# EasyEDA Pro project OpenCardiographySignalMeasuringDevice.epro, board PCB_MasterProject
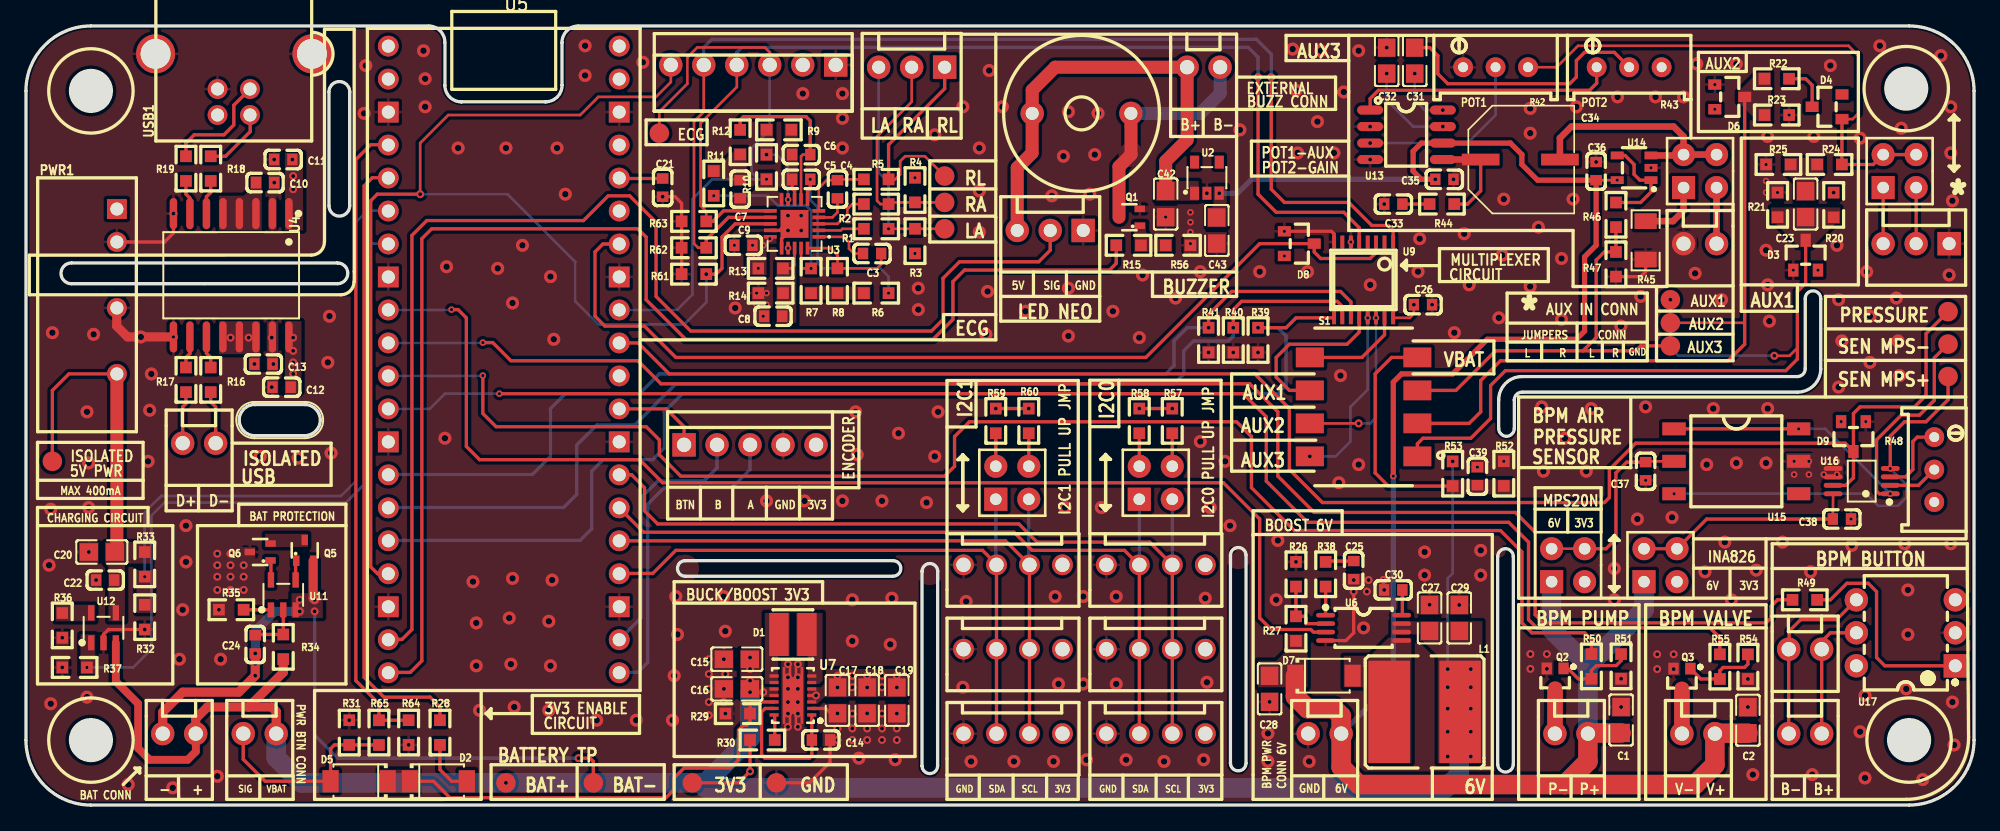
[diagram p6: board, top side]
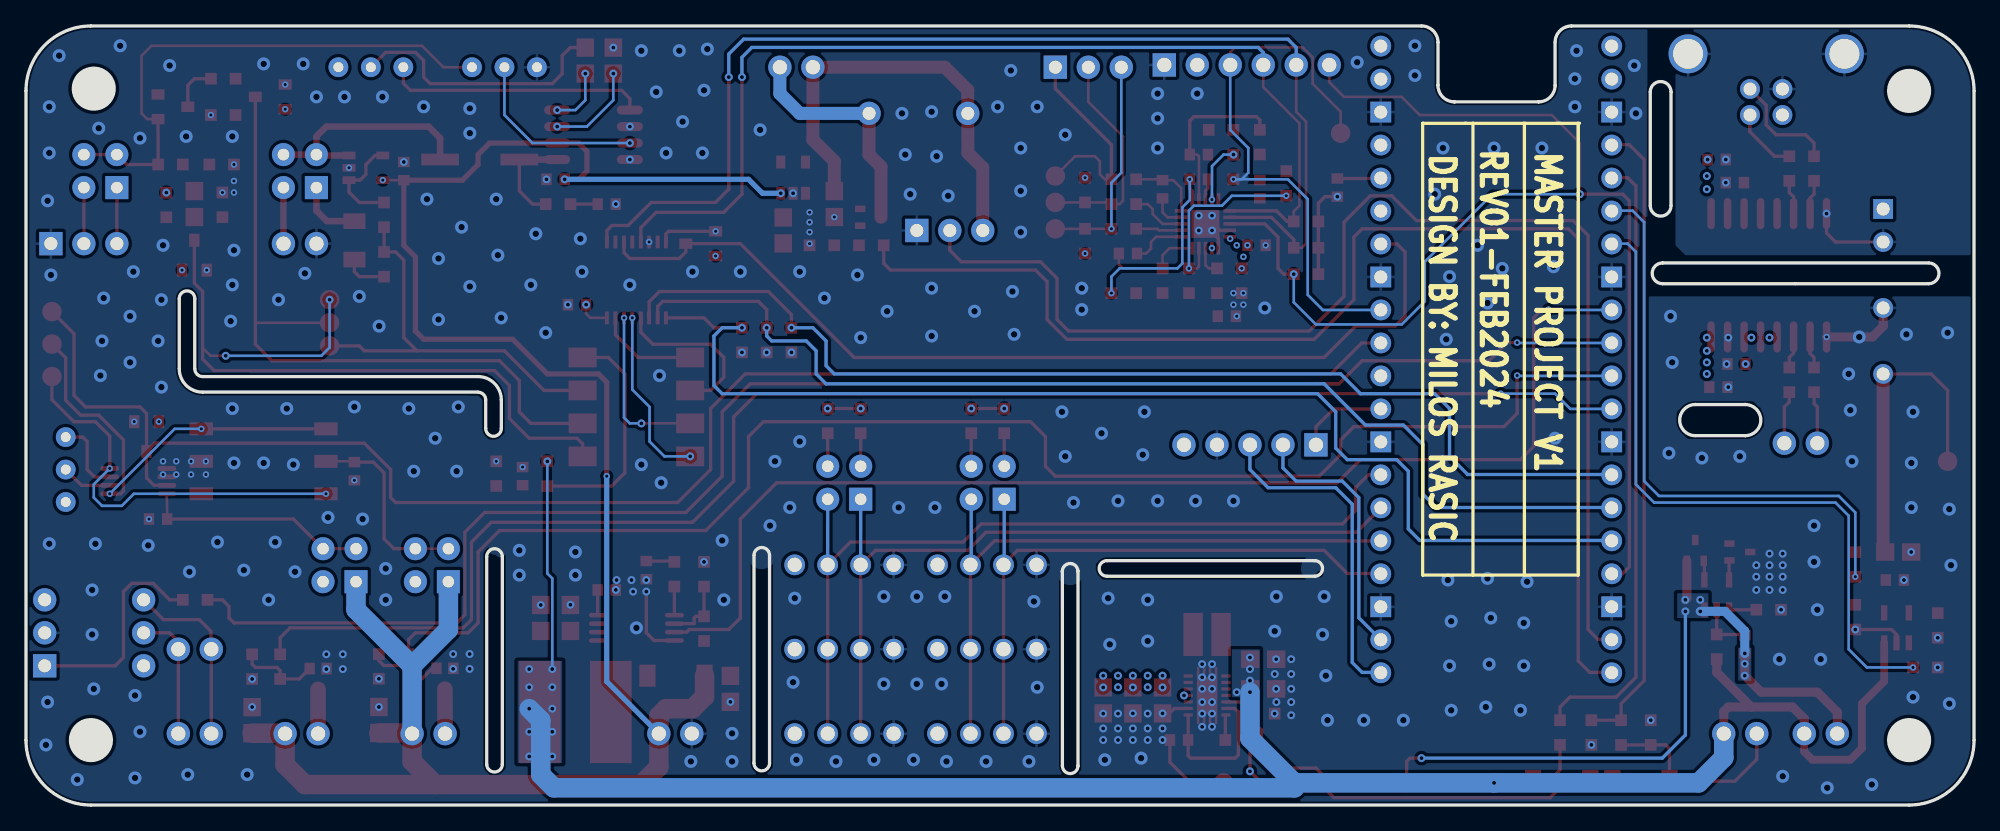
[diagram p7: board, bottom side, seen from below]

Outline 150 x 60 mm; copper layers: Top Layer, GND, 3V3, Bottom Layer. Coordinates in mm from the lower left corner of the outline.
Outline path: 0,55 arc(1.46,58.54) 5,60 30.99,60 arc(31.89,59.63) 32.26,58.73 32.26,55.43 32.26,55.43 arc(32.63,54.53) 33.53,54.16 33.53,54.16 40,54.16 40,54.16 arc(40.9,54.53) 41.28,55.43 41.28,58.73 41.27,58.73 arc(41.65,59.63) 42.55,60 145,60 arc(148.54,58.54) 150,55 150,5 arc(148.54,1.46) 145,0 5,0 arc(1.46,1.46) 0,5 0,55 ; 3.5,40.15 arc(2.7,40.95) 3.5,41.75 23.98,41.75 arc(24.78,40.95) 23.98,40.15 3.5,40.15 ; 17.62,30.85 17.62,30.85 arc(16.42,29.65) 17.62,28.45 21.46,28.45 arc(22.66,29.65) 21.46,30.85 21.46,30.85 17.62,30.85 ; 23.33,54.92 23.33,46.16 arc(24.13,45.36) 24.93,46.16 24.93,54.92 arc(24.13,55.72) 23.33,54.92 ; 50.77,18.82 66.76,18.82 arc(67.37,18.22) 66.76,17.62 50.77,17.62 arc(50.17,18.22) 50.77,18.82 ; 69,3.02 69,3.02 69,18 69,18 arc(69.6,18.6) 70.2,18 70.2,3.02 arc(69.6,2.42) 69,3.02 ; 92.75,19.23 arc(93.34,19.83) 93.94,19.23 93.94,3.23 arc(93.34,2.63) 92.75,3.23 92.75,19.23 ; 113.32,19.14 113.32,3.14 arc(113.92,2.54) 114.52,3.14 114.52,19.14 arc(113.92,19.74) 113.32,19.14 ; 113.4,31.2 113.4,29 arc(114,28.4) 114.6,29 114.6,31.2 arc(114.78,31.62) 115.2,31.8 136.4,31.8 arc(137.67,32.33) 138.2,33.6 138.2,39 arc(137.6,39.6) 137,39 137,33.6 arc(136.82,33.18) 136.4,33 115.2,33 arc(113.93,32.47) 113.4,31.2
Stack: Top Layer 0.035mm / Dielectric1 0.48mm PP er 4.5 / GND 0.035mm / Dielectric2 0.48mm FR4 er 4.5 / 3V3 0.035mm / Dielectric3 0.48mm PP er 4.5 / Bottom Layer 0.035mm

## Design rules (mm)
spacing Default (default): track to track 0.1, other pairs 0 to 0.1
track width Default (default): min 0.2, default 0.2, max 25.4
differential pair differentialPair (default): width min 0.127, default 0.254, max 2.54; gap min 0.152, default 0.152
via Default (default): diameter min 0.5, default 0.5, max 100.025; hole min 0.25, default 0.25, max 59.995
net GND uses gge34940
net USB_GND uses gge34982
net 5V_USB uses gge23894
net 3V3 uses gge34130
pour e198 uses gge34970
pour e199 uses gge34976
pour e211 uses gge23894
pour e212 uses gge34130
pour e213 uses gge23885
pour e214 uses gge34073
pour e966 uses gge34940
pour e967 uses gge34982

## Placement (name value [footprint] x y rotation side)
BUZZER1  BUZZER-12X9  [BUZ-TH_BD12.0-P7.60-D0.6-FD]  81.28 53.27 0 top
C1  10uF  [C0805]  122.82 6.55 90 top
C2  10uF  [C0805]  132.59 6.53 90 top
C3  33nF  [C0603]  65.15 42.47 0 top
C4  1nF  [C0603]  62.48 47.43 270 top
C5  330nF  [C0603]  59.69 48.19 180 top
C6  10nF  [C0603]  59.69 50.09 180 top
C7  1.5nF  [C0603]  54.99 47.43 270 top
C8  100nF  [C0603]  57.53 37.65 0 top
C9  100nF  [C0603]  55.25 43.11 0 top
C10  100nF  [C0603]  18.42 47.94 0 top
C11  100nF  [C0603]  19.81 49.71 0 top
C12  100nF  [C0603]  19.69 32.19 180 top
C13  100nF  [C0603]  18.29 33.97 0 top
C14  100nF  [C0603]  61.21 5.01 0 top
C15  10uF  [C0805]  54.74 11.23 0 top
C16  10uF  [C0805]  54.74 8.95 0 top
C17  22uF  [C0805]  62.48 8.06 90 top
C18  22uF  [C0805]  64.77 8.06 90 top
C19  22uF  [C0805]  67.06 8.06 90 top
C20  22uF  [C0805]  5.84 19.49 180 top
C21  100nF  [C0603]  49.02 47.55 270 top
C22  100nF  [C0603]  6.1 17.33 180 top
C23  10uF  [C0805]  137.03 46.28 90 top
C24  100nF  [C0603]  17.65 12.38 90 top
C25  1.1nF  [C0603]  102.24 18.09 90 top
C26  100nF  [C0603]  107.57 38.54 180 top
C27  22uF  [C0805]  108.08 14.41 90 top
C28  22uF  [C0805]  95.76 8.95 270 top
C29  1uF  [C0805]  110.36 14.41 90 top
C30  100nF  [C0603]  105.28 16.57 0 top
C31  10uF  [C0805]  106.93 57.33 90 top
C32  10uF  [C0805]  104.78 57.33 270 top
C33  50nF  [C0603]  105.28 46.28 180 top
C34  250uF  [8X10.5]  115.06 49.71 0 top
C35  100nF  [C0603]  109.22 48.19 0 top
C36  100nF  [C0603]  120.9 48.82 90 top
C37  100nF  [C0603]  124.71 25.71 90 top
C38  100nF  [C0603]  139.83 22.03 0 top
C39  100nF  [C0603]  111.76 25.33 90 top
C42  10uF  [C0805]  87.76 46.28 90 top
C43  10uF  [C0805]  91.69 44.25 90 top
CN1  kf2510_3A  [CONN-TH_3P-P2.00_KF2510_3A]  68.2 56.83 0 top
CN2  PICO USB SIGNAL  [CONN-TH_KF2510-2A]  13.33 27.87 0 top
CN3  kf2510_3A  [CONN-TH_3P-P2.00_KF2510_3A]  145.54 43.24 0 top
CN4  KF2510-6A  [CONN-TH_KF2510-6A]  56 57 180 top
CN5  Speaker  [CONN-TH_KF2510-2A]  128.91 43.24 0 top
CN6  BPM PSU  [CONN-TH_KF2510-2A]  100 5.5 0 top
CN7  BPM BUTTON  [CONN-TH_KF2510-2A]  137 12 0 top
CN8  BUTTON2  [CONN-TH_KF2510-2A]  137 5.5 0 top
CN9  PUMP  [CONN-TH_KF2510-2A]  119 5.5 0 top
CN10  VALVE  [CONN-TH_KF2510-2A]  128.78 5.5 0 top
CN11  Button  [CONN-TH_KF2510-2A]  18 5.5 0 top
CN12  Battery  [CONN-TH_KF2510-2A]  11.8 5.5 0 top
CN13  LED_CONN  [CONN-TH_3P-P2.00_KF2510_3A]  78.87 44.25 0 top
CN14  BUZZER  [CONN-TH_KF2510-2A]  90.68 56.83 0 top
D1  1.5uH  [IND-SMD_L3.0-W3.0-HPC3015TF-2R2M]  59.06 13.14 0 top
D2  RB050LAM-40TFTR  [SOD-128_L3.7-W2.5-LS4.7-RD]  31.75 1.83 0 top
D3  BAR43SFILM  [SOT-23_L2.9-W1.3-P1.90-LS2.4-BR]  137.03 42.35 270 top
D4  BAR43SFILM  [SOT-23_L2.9-W1.3-P1.90-LS2.4-BR]  138.68 53.78 0 top
D5  RB050LAM-40TFTR  [SOD-128_L3.7-W2.5-LS4.7-RD]  25.65 1.83 180 top
D6  BAR43SFILM  [SOT-23_L2.9-W1.3-P1.90-LS2.4-BR]  131.19 54.54 180 top
D7  RB050LAM-40TFTR  [SOD-128_L3.7-W2.5-LS4.7-RD]  99.95 9.96 0 top
D8  BAR43SFILM  [SOT-23_L2.9-W1.3-P1.90-LS2.4-BR]  98.04 43.24 180 top
D9  BAR43SFILM  [SOT-23_L2.9-W1.3-P1.90-LS2.4-BR]  140.72 28.38 90 top
L1  MSS7341-104MLD  [IND-SMD_L7.3-W7.3_MSS7341-104MLD]  107.7 7.17 0 top
MH1  M3 Screw  [MOUNTINGHOLE-M3]  5 5 0 top
MH2  M3 Screw  [MOUNTINGHOLE-M3]  145 5 0 top
MH3  M3 Screw  [MOUNTINGHOLE-M3]  144.78 55.17 0 top
MH4  M3 Screw  [MOUNTINGHOLE-M3]  5 55 0 top
P1  INA125 JMPR BLOCK  [2X2X2.54MM HEADER]  144.27 47.55 0 top
P2  SPEAKER JMP  [2X2X2.54MM HEADER]  128.91 47.55 0 top
P3  INA826_PWR_JMP  [2X2X2.54MM HEADER]  125.86 17.2 0 top
P4  Encoder  [CONN-TH_5P-P2.54_KF2510-5A]  55.75 27.74 0 top
P5  KF2510-4A  [CONN-TH_4P-P2.54_KF2510-4A]  87 18.5 0 top
P6  KF2510-4A  [CONN-TH_4P-P2.54_KF2510-4A]  87 12 0 top
P7  KF2510-4A  [CONN-TH_4P-P2.54_KF2510-4A]  87 5.5 0 top
P9  I2C PU  [2X2X2.54MM HEADER]  87 23.55 0 top
P10  I2C PU  [2X2X2.54MM HEADER]  75.95 23.55 0 top
P12  KF2510-4A  [CONN-TH_4P-P2.54_KF2510-4A]  76 18.5 0 top
P13  KF2510-4A  [CONN-TH_4P-P2.54_KF2510-4A]  76 12 0 top
P14  KF2510-4A  [CONN-TH_4P-P2.54_KF2510-4A]  76 5.5 0 top
P15  MPS_PWR_JMP  [2X2X2.54MM HEADER]  118.75 17.2 0 top
PWR1  TBA 2-1211  [PWRM-TH_TBA-2-1211]  7 39.55 270 top
Q1  BSS138BKW  [SOT323]  84.96 45.27 90 top
Q2  DMN2310UW-7  [PG-SOT323-3_L2.0-W1.3-P1.30-LS2.1-BR]  117.74 9.72 90 top
Q3  DMN2310UW-7  [PG-SOT323-3_L2.0-W1.3-P1.30-LS2.1-BR]  127.51 9.71 90 top
Q5  BSS138BKW  [SOT323]  21.46 19.61 0 top
Q6  BSS138BKW  [SOT323]  18.03 19.49 90 top
R1  .  [20K OHM RESISTOR (0603) SMD - CRCW060320K0FKEAC]  66.42 44.38 180 top
R2  .  [20K OHM RESISTOR (0603) SMD - CRCW060320K0FKEAC]  66.42 46.28 180 top
R3  .  [20K OHM RESISTOR (0603) SMD - CRCW060320K0FKEAC]  68.45 44.38 270 top
R4  .  [20K OHM RESISTOR (0603) SMD - CRCW060320K0FKEAC]  68.45 46.41 90 top
R5  .  [20K OHM RESISTOR (0603) SMD - CRCW060320K0FKEAC]  66.42 48.19 180 top
R6  .  [20K OHM RESISTOR (0603) SMD - CRCW060320K0FKEAC]  66.42 39.43 180 top
R7  .  [20K OHM RESISTOR (0603) SMD - CRCW060320K0FKEAC]  60.45 39.43 90 top
R8  .  [20K OHM RESISTOR (0603) SMD - CRCW060320K0FKEAC]  62.48 41.33 270 top
R9  .  [20K OHM RESISTOR (0603) SMD - CRCW060320K0FKEAC]  58.93 52 180 top
R10  .  [20K OHM RESISTOR (0603) SMD - CRCW060320K0FKEAC]  57.02 50.09 270 top
R11  .  [20K OHM RESISTOR (0603) SMD - CRCW060320K0FKEAC]  52.96 48.82 270 top
R12  .  [20K OHM RESISTOR (0603) SMD - CRCW060320K0FKEAC]  54.99 52 270 top
R13  .  [20K OHM RESISTOR (0603) SMD - CRCW060320K0FKEAC]  56.39 41.33 0 top
R14  .  [20K OHM RESISTOR (0603) SMD - CRCW060320K0FKEAC]  58.29 39.43 180 top
R15  .  [20K OHM RESISTOR (0603) SMD - CRCW060320K0FKEAC]  85.85 43.11 180 top
R16  .  [20K OHM RESISTOR (0603) SMD - CRCW060320K0FKEAC]  14.22 33.7 270 top
R17  .  [20K OHM RESISTOR (0603) SMD - CRCW060320K0FKEAC]  12.32 33.7 270 top
R18  .  [20K OHM RESISTOR (0603) SMD - CRCW060320K0FKEAC]  14.22 49.97 270 top
R19  .  [20K OHM RESISTOR (0603) SMD - CRCW060320K0FKEAC]  12.32 49.97 270 top
R20  .  [20K OHM RESISTOR (0603) SMD - CRCW060320K0FKEAC]  139.19 45.27 90 top
R21  .  [20K OHM RESISTOR (0603) SMD - CRCW060320K0FKEAC]  134.87 47.17 270 top
R22  .  [20K OHM RESISTOR (0603) SMD - CRCW060320K0FKEAC]  133.86 55.94 0 top
R23  .  [20K OHM RESISTOR (0603) SMD - CRCW060320K0FKEAC]  135.76 53.14 180 top
R24  .  [20K OHM RESISTOR (0603) SMD - CRCW060320K0FKEAC]  137.92 49.33 0 top
R25  .  [20K OHM RESISTOR (0603) SMD - CRCW060320K0FKEAC]  133.99 49.33 0 top
R26  .  [20K OHM RESISTOR (0603) SMD - CRCW060320K0FKEAC]  97.79 18.72 270 top
R27  .  [20K OHM RESISTOR (0603) SMD - CRCW060320K0FKEAC]  97.79 14.53 270 top
R28  .  [20K OHM RESISTOR (0603) SMD - CRCW060320K0FKEAC]  31.88 6.53 270 top
R29  .  [20K OHM RESISTOR (0603) SMD - CRCW060320K0FKEAC]  55.75 7.04 180 top
R30  .  [20K OHM RESISTOR (0603) SMD - CRCW060320K0FKEAC]  55.75 5.01 0 top
R31  .  [20K OHM RESISTOR (0603) SMD - CRCW060320K0FKEAC]  24.89 6.53 270 top
R32  .  [20K OHM RESISTOR (0603) SMD - CRCW060320K0FKEAC]  9.14 13.52 90 top
R33  .  [20K OHM RESISTOR (0603) SMD - CRCW060320K0FKEAC]  9.14 17.58 90 top
R34  .  [20K OHM RESISTOR (0603) SMD - CRCW060320K0FKEAC]  19.81 13.14 270 top
R35  .  [20K OHM RESISTOR (0603) SMD - CRCW060320K0FKEAC]  14.86 15.04 0 top
R36  .  [20K OHM RESISTOR (0603) SMD - CRCW060320K0FKEAC]  2.79 12.88 90 top
R37  .  [20K OHM RESISTOR (0603) SMD - CRCW060320K0FKEAC]  2.79 10.6 0 top
R38  .  [20K OHM RESISTOR (0603) SMD - CRCW060320K0FKEAC]  100.08 18.72 270 top
R39  .  [20K OHM RESISTOR (0603) SMD - CRCW060320K0FKEAC]  94.87 34.86 90 top
R40  .  [20K OHM RESISTOR (0603) SMD - CRCW060320K0FKEAC]  92.96 34.86 90 top
R41  .  [20K OHM RESISTOR (0603) SMD - CRCW060320K0FKEAC]  91.06 34.86 90 top
R42  10k  [RES-ADJ-TH_3P-L9.5-W4.85-P2.50-BL-BS]  113.16 56.83 90 top
R43  10k  [RES-ADJ-TH_3P-L9.5-W4.85-P2.50-BL-BS]  123.44 56.83 90 top
R44  .  [20K OHM RESISTOR (0603) SMD - CRCW060320K0FKEAC]  108.08 46.28 0 top
R45  8R2/1206  [R1206]  124.71 43.49 90 top
R46  .  [20K OHM RESISTOR (0603) SMD - CRCW060320K0FKEAC]  122.43 44.51 90 top
R47  .  [20K OHM RESISTOR (0603) SMD - CRCW060320K0FKEAC]  122.43 40.7 90 top
R48  20Ω  [RES-ADJ-TH_3P-L9.5-W4.85-P2.50-BL-BS]  146.94 25.84 0 top
R49  .  [20K OHM RESISTOR (0603) SMD - CRCW060320K0FKEAC]  137.92 15.8 180 top
R50  .  [20K OHM RESISTOR (0603) SMD - CRCW060320K0FKEAC]  120.54 9.72 90 top
R51  .  [20K OHM RESISTOR (0603) SMD - CRCW060320K0FKEAC]  122.82 9.72 90 top
R52  .  [20K OHM RESISTOR (0603) SMD - CRCW060320K0FKEAC]  113.79 26.47 270 top
R53  .  [20K OHM RESISTOR (0603) SMD - CRCW060320K0FKEAC]  109.85 24.57 90 top
R54  .  [20K OHM RESISTOR (0603) SMD - CRCW060320K0FKEAC]  132.59 9.71 90 top
R55  .  [20K OHM RESISTOR (0603) SMD - CRCW060320K0FKEAC]  130.43 9.71 90 top
R56  .  [20K OHM RESISTOR (0603) SMD - CRCW060320K0FKEAC]  89.66 43.11 180 top
R57  .  [20K OHM RESISTOR (0603) SMD - CRCW060320K0FKEAC]  88.26 30.54 270 top
R58  .  [20K OHM RESISTOR (0603) SMD - CRCW060320K0FKEAC]  85.72 30.54 270 top
R59  .  [20K OHM RESISTOR (0603) SMD - CRCW060320K0FKEAC]  74.68 30.54 270 top
R60  .  [20K OHM RESISTOR (0603) SMD - CRCW060320K0FKEAC]  77.22 30.54 270 top
R61  .  [20K OHM RESISTOR (0603) SMD - CRCW060320K0FKEAC]  50.48 40.89 0 top
R62  .  [20K OHM RESISTOR (0603) SMD - CRCW060320K0FKEAC]  50.48 42.92 0 top
R63  .  [20K OHM RESISTOR (0603) SMD - CRCW060320K0FKEAC]  50.48 44.95 0 top
R64  .  [20K OHM RESISTOR (0603) SMD - CRCW060320K0FKEAC]  29.46 6.53 270 top
R65  .  [20K OHM RESISTOR (0603) SMD - CRCW060320K0FKEAC]  27.18 4.63 90 top
S1  1825058-7  [SW_1825058-7]  103 30.66 180 top
TP1  Testpoint 3V3  [TESTPOINT]  51.31 1.71 0 top
TP2  Testpoint VBAT  [TESTPOINT]  36.96 1.71 0 top
TP3  Testpoint VBAT_NEG  [TESTPOINT]  43.69 1.71 0 top
TP4  Testpoint 6V  [TESTPOINT]  109.35 1.58 0 top
TP5  Testpoint GND  [TESTPOINT]  57.78 1.71 0 top
TP6  TP_ECG  [TESTPOINT]  48.77 51.75 0 top
TP7  TP_LA  [TESTPOINT]  70.74 44.38 0 top
TP8  TP_RA  [TESTPOINT]  70.74 46.41 0 top
TP9  TP_RL  [TESTPOINT]  70.74 48.44 0 top
TP10  TP_AUX1  [TESTPOINT]  126.62 38.92 0 top
TP11  TP_AUX2  [TESTPOINT]  126.62 37.14 0 top
TP12  TP_AUX3  [TESTPOINT]  126.62 35.36 0 top
TP13  5V_SAFE  [TESTPOINT]  2.03 26.47 0 top
TP14  TP_PRESSURE  [TESTPOINT]  148 38 0 top
TP15  MPS+  [TESTPOINT]  148 33 0 top
TP16  MPS-  [TESTPOINT]  148 35.5 0 top
U2  NCP716BSN500T1G  [TSOP-5_L3.0-W1.5-P0.95-LS2.8-BL]  90.93 48.32 0 top
U3  AD8232ACPZ-R7  [LFCSP-20_L4.0-W4.0-P0.50-TL-EP2.7]  59.18 44.76 180 top
U4  ADUM3160BRWZ-RL  [SOIC-16_L10.3-W7.5-P1.27-LS10.3-BL]  15.8 40.8 180 top
U5  Raspberry Pi Pico  [RASPBERRY PI PICO/ RASPBERRY PI PICO W]  26.29 8.82 0 top
U6  TPS61085PWR  [TSSOP-8_L4.4-W3.0-P0.65-LS6.4-BL]  103 13.64 270 top
U7  TPS63021DSJR  [VSON-14_L4.0-W3.0-P0.50-BL-EP_TI_DSJ]  59.06 8.44 90 top
U9  XS3A4051PWJ  [TSSOP16_]  103 40.44 180 top
U11  AP9101CK-AHTRG1  [SOT-23-5_L3.0-W1.7-P0.95-LS2.8-BL]  19.81 16.19 0 top
U12  MCP73831T-2ACI/OT  [SOT-23-5_L3.0-W1.7-P0.95-LS2.8-BL]  5.97 13.64 0 top
U13  LM386M-1/NOPB  [SOIC-8_L4.9-W3.9-P1.27-LS6.0-BL-2]  106.3 51.62 270 top
U14  MCP6001T-I/OT  [SOT-23-5_L3.0-W1.7-P0.95-LS2.8-BR]  123.82 49.08 0 top
U15  -  [MPS20N0040D-S]  131.7 26.47 0 top
U16  INA826AIDGK  [VSSOP-8_L3.0-W3.0-P0.65-LS4.9-BL]  141.35 24.95 90 top
U17  4N27M  [DIP-6_L8.8-W6.4-P2.54-LS7.6-BL]  144.75 13.26 90 top
USB1  670688000  [USB-B-TH_67068-8000]  16 55.5 180 top

## Footprints (pads in the part's own frame, mm; a bottom-side part is the same pattern mirrored in y, then rotated)
2X2X2.54MM HEADER
  rect 1.778x1.778 hole 0.889: 1(-1.27,0)
  round 1.778 hole 0.889: 2(1.27,0) 3(-1.27,2.54) 4(1.27,2.54)
8X10.5
  rect 2.9x0.9 smd: +(-3.05,0) -(3.05,0)
20K OHM RESISTOR (0603) SMD - CRCW060320K0FKEAC
  rect 0.9x0.9 smd: 1(0,0) 2(1.9,0)
BUZ-TH_BD12.0-P7.60-D0.6-FD
  round 1.8 hole 1: 1(-3.8,0) 2(3.8,0)
C0603
  rect 0.8x0.9 smd: 1(-0.7,0) 2(0.7,0)
C0805
  rect 1.41x1.35 smd: 1(-1,0) 2(1,0)
CONN-TH_3P-P2.00_KF2510_3A
  rect 1.8x1.8 hole 1: 1(2.54,0)
  round 1.8 hole 1: 2(0,0) 3(-2.54,0)
CONN-TH_4P-P2.54_KF2510-4A
  round 1.6 hole 1.1: 1(-3.81,0) 2(-1.27,0) 3(1.27,0) 4(3.81,0)
CONN-TH_5P-P2.54_KF2510-5A
  rect 1.8x1.8 hole 1.1: 1(-5.08,0)
  round 1.8 hole 1.1: 2(-2.54,0) 3(0,0) 4(2.54,0) 5(5.08,0)
CONN-TH_KF2510-2A
  round 1.8 hole 1.1: 1(1.27,0) 2(-1.27,0)
CONN-TH_KF2510-6A
  rect 1.8x1.8 hole 1.1: 1(-6.35,0)
  round 1.8 hole 1.1: 2(-3.81,0) 3(-1.27,0) 4(1.27,0) 5(3.81,0) 6(6.35,0)
DIP-6_L8.8-W6.4-P2.54-LS7.6-BL
  rect 1.8x1.8 hole 1: 1(-2.54,-3.81)
  round 1.8 hole 1: 2(0,-3.81) 3(2.54,-3.81) 4(2.54,3.81) 5(0,3.81) 6(-2.54,3.81)
IND-SMD_L3.0-W3.0-HPC3015TF-2R2M
  rect 1.5x3.32 smd: 1(1.078,0) 2(-1.078,0)
IND-SMD_L7.3-W7.3_MSS7341-104MLD
  rect 3.2x7.884 smd: 1(-2.73,0) 2(2.73,0)
LFCSP-20_L4.0-W4.0-P0.50-TL-EP2.7
  rect 0.985x0.28 smd: 1(-1.867,1) 2(-1.867,0.5) 3(-1.867,0) 4(-1.867,-0.5) 5(-1.867,-1) 11(1.867,-1) 12(1.867,-0.5) 13(1.867,0) 14(1.867,0.5) 15(1.867,1)
  rect 0.28x0.985 smd: 6(-1,-1.867) 7(-0.5,-1.867) 8(0,-1.867) 9(0.5,-1.867) 10(1,-1.867) 16(1,1.867) 17(0.5,1.867) 18(0,1.867) 19(-0.5,1.867) 20(-1,1.867)
  rect 2.15x2.15 smd: 21(0,0)
MPS20N0040D-S
  rect 1.8x1 smd: 1(-4.8,2.5) 2(-4.8,0) 3(-4.8,-2.5) 4(4.8,2.5) 5(4.8,0) 6(4.8,-2.5)
PG-SOT323-3_L2.0-W1.3-P1.30-LS2.1-BR
  rect 0.9x0.8 smd: 1(0.8,-0.65) 2(0.8,0.65) 3(-0.8,0)
PWRM-TH_TBA-2-1211
  rect 1.524x1.524 hole 1: 1(-6.35,0)
  round 1.524 hole 1: 2(-3.81,0) 4(1.27,0) 6(6.35,0)
R1206
  rect 1.208x1.701 smd: 1(-1.479,0) 2(1.479,0)
RASPBERRY PI PICO/ RASPBERRY PI PICO W
  round 1.6 hole 1: 1(1.61,49.63) 2(1.61,47.09) 4(1.61,42.01) 5(1.61,39.47) 6(1.61,36.93) 7(1.61,34.39) 9(1.61,29.31) 10(1.61,26.77) 11(1.61,24.23) 12(1.61,21.69) 14(1.61,16.61) 15(1.61,14.07) 16(1.61,11.53) 17(1.61,8.99) 19(1.61,3.91) 20(1.61,1.37) 21(19.39,1.37) 22(19.39,3.91) 24(19.39,8.99) 25(19.39,11.53) 26(19.39,14.07) 27(19.39,16.61) 29(19.39,21.69) 30(19.39,24.23) 31(19.39,26.77) 32(19.39,29.31) 34(19.39,34.39) 35(19.39,36.93) 36(19.39,39.47) 37(19.39,42.01) 39(19.39,47.09) 40(19.39,49.63)
  rect 1.6x1.6 hole 1: 3(1.61,44.55) 8(1.61,31.85) 13(1.61,19.15) 18(1.61,6.45) 23(19.39,6.45) 28(19.39,19.15) 33(19.39,31.85) 38(19.39,44.55)
RES-ADJ-TH_3P-L9.5-W4.85-P2.50-BL-BS
  round 1.524 hole 0.762: 1(0,2.5) 2(0,0) 3(0,-2.5)
SOD-128_L3.7-W2.5-LS4.7-RD
  rect 1.25x1.7 smd: 1(-2.2,0) 2(2.2,0)
SOIC-8_L4.9-W3.9-P1.27-LS6.0-BL-2
  oval 0.7x2 smd: 1(-1.905,-2.8) 2(-0.635,-2.8) 3(0.635,-2.8) 4(1.905,-2.8) 5(1.905,2.8) 6(0.635,2.8) 7(-0.635,2.8) 8(-1.905,2.8)
SOIC-16_L10.3-W7.5-P1.27-LS10.3-BL
  oval 0.574x2.401 smd: 1(-4.445,-4.75) 2(-3.175,-4.75) 3(-1.905,-4.75) 4(-0.635,-4.75) 5(0.635,-4.75) 6(1.905,-4.75) 7(3.175,-4.75) 8(4.445,-4.75) 9(4.445,4.75) 10(3.175,4.75) 11(1.905,4.75) 12(0.635,4.75) 13(-0.635,4.75) 14(-1.905,4.75) 15(-3.175,4.75) 16(-4.445,4.75)
SOT323
  custom 0.5x0.8 smd: 1(-0.65,-0.8) 2(0.65,-0.8) 3(0,0.8)
SOT-23-5_L3.0-W1.7-P0.95-LS2.8-BL
  rect 0.49x1.157 smd: 1(-0.95,-1.153) 2(0,-1.153) 3(0.95,-1.153)
  rect 0.49x1.175 smd: 4(0.95,1.153) 5(-0.95,1.153)
SOT-23-5_L3.0-W1.7-P0.95-LS2.8-BR
  rect 1x0.6 smd: 1(1.3,-0.95) 2(1.3,0) 3(1.3,0.95) 4(-1.3,0.95) 5(-1.3,-0.95)
SOT-23_L2.9-W1.3-P1.90-LS2.4-BR
  rect 1x0.8 smd: 1(1.15,-0.95) 2(1.15,0.95) 3(-1.15,0)
SW_1825058-7
  rect 2.159x1.519 smd: 1(-4.14,3.81) 2(4.14,3.81) 3(-4.14,1.27) 4(4.14,1.27) 5(-4.14,-1.27) 6(4.14,-1.27) 7(-4.14,-3.81) 8(4.14,-3.81)
TESTPOINT
  round 1.5 smd: 1(0,0)
TSOP-5_L3.0-W1.5-P0.95-LS2.8-BL
  rect 0.7x1 smd: 1(-0.95,-1.2) 2(0,-1.2) 3(0.95,-1.2) 4(0.95,1.2) 5(-0.95,1.2)
TSSOP16_
  rect 0.305x0.991 smd: 1(-2.273,-2.921) 2(-1.613,-2.921) 3(-0.953,-2.921) 4(-0.318,-2.921) 5(0.343,-2.921) 6(0.978,-2.921) 7(1.639,-2.921) 8(2.273,-2.921) 9(2.273,2.921) 10(1.639,2.921) 11(0.978,2.921) 12(0.343,2.921) 13(-0.318,2.921) 14(-0.953,2.921) 15(-1.613,2.921) 16(-2.273,2.921)
TSSOP-8_L4.4-W3.0-P0.65-LS6.4-BL
  oval 0.353x1.454 smd: 1(-0.975,-2.927) 2(-0.325,-2.927) 3(0.325,-2.927) 4(0.975,-2.927) 5(0.975,2.927) 6(0.325,2.927) 7(-0.325,2.927) 8(-0.975,2.927)
USB-B-TH_67068-8000
  round 1.524 hole 1: 1(1.25,2.355) 2(-1.25,2.355) 3(-1.25,0.355) 4(1.25,0.355)
  round 3 hole 2.3: 5(6.02,-2.354) 6(-6.02,-2.354)
VSON-14_L4.0-W3.0-P0.50-BL-EP_TI_DSJ
  rect 0.25x0.7 smd: 1(-1.5,-1.45) 2(-1,-1.45) 3(-0.5,-1.45) 4(0,-1.45) 5(0.5,-1.45) 6(1,-1.45) 7(1.5,-1.45) 8(1.5,1.45) 9(1,1.45) 10(0.5,1.45) 11(0,1.45) 12(-0.5,1.45) 13(-1,1.45) 14(-1.5,1.45)
  custom 4.4x1.58 smd: 15(0,0)
VSSOP-8_L3.0-W3.0-P0.65-LS4.9-BL
  oval 0.38x1.45 smd: 1(-0.975,-2.2) 2(-0.325,-2.2) 3(0.325,-2.2) 4(0.975,-2.2) 5(0.975,2.2) 6(0.325,2.2) 7(-0.325,2.2) 8(-0.975,2.2)

## Nets
As in the schematic.

Pads without a net: D4 2; R43 3; R48 3; U2 4 5; U5 1 2 30 35 37 39 40; U9 2 4 7; U15 6; U17 3 6

## Via types
v1: diameter 0.5, hole 0.25, Top Layer to Bottom Layer, 68 vias
v2: diameter 1, hole 0.5, Top Layer to Bottom Layer, 243 vias
v3: diameter 0.61, hole 0.305, Top Layer to Bottom Layer, 171 vias
v4: diameter 0.601, hole 0.305, Top Layer to Bottom Layer, 1 via

## Routing (per net, layer and track width the routed paths; a pad name or vN(x,y) marks a point on that pad's centre or on a via; arc(x,y) is an arc through that point)
3V3: length 18.1
  Top Layer w0.2: v3(106.87,38.54) 106.87,37.84 106.55,37.52 U9.16
  Top Layer w0.254: U5.36 45.71,48.25 C21.1 ; R30.1 v3(55.75,2.6) 54.86,1.71 TP1.1 ; v3(85.72,30.54) v3(88.26,30.54) ; v3(74.68,30.54) v3(77.22,30.54)
  vias: v1(55.94,43.11) v1(56.26,42.22) v1(56.39,41.33) v1(56.77,43.11) v1(57.28,43.62) v1(58.68,42.89) v1(68.45,48.31) v1(68.45,42.48) v1(96.89,42.29) v1(130.04,53.59) v1(137.98,41.2) v1(139.77,29.53) v3(15.75,36) v3(17.14,36) v3(17.59,33.97) v3(20.57,36) v3(20.57,34.98) v3(20.57,34.09) v3(20.57,33.2) v3(60.83,8.44) v3(62.48,9.96) v3(62.48,9.06) v3(63.63,9.96) v3(63.63,9.07) v3(64.77,9.96) v3(64.77,9.06) v3(65.91,9.96) v3(65.91,9.07) v3(67.06,9.96) v3(67.06,9.06) v3(139.19,47.17)
5V: length 34.2
  Top Layer w1: CN13.3 76.33,49.08 77.47,50.22 BUZZER1.1 77.48,55.06 79.25,56.83 CN14.2 89.41,51.24 87.76,49.59 C42.2
5V_SAFE: length 24.8
  Top Layer w0.254: PWR1.6 3.3,33.2 2.03,31.93 TP13.1
  Top Layer w1: PWR1.6 7,19.49 6.84,19.49
5V_USB:
  vias: v3(20.51,49.71) v3(20.57,48.44) v3(20.57,47.43)
6V: length 168.2
  Top Layer w0.2: C36.1 v1(122.52,48.13)
  Top Layer w0.4: 109.1,50.98 114.3,50.98 115.19,50.09 115.19,49.33 116.39,48.12 C36.1 120.9,43.11 120.01,42.22 120.01,36.5 119.38,35.87 112.52,35.87 109.85,33.2 105.92,33.2 105.28,32.57 v1(105.28,25.33) ; v3(108.52,48.19) 107.44,48.19 106.81,48.82 106.81,50.35 107.44,50.98 109.1,50.98
  Top Layer w1.5: C2.1 130.08,5.53 CN10.1 130.05,3.1 128.52,1.58 118.49,1.58 ; 120.27,5.52 120.3,5.55 C1.1 ; 118.49,1.58 120.27,3.36 CN9.1 ; 118.49,1.58 TP4.1 102.62,1.58 101.27,2.93 CN6.1 101.27,6.86 100.71,7.42 98.68,7.42 97.75,8.35 97.75,9.96
  Bottom Layer w0.4: v3(108.52,48.19) 94.36,48.19 93.29,47.12 v3(91.88,47.12) ; v1(105.28,25.33) 105.28,9.51 CN6.1
  Bottom Layer w1.5: P3.1 124.59,15.04 120.27,10.72 ; 120.27,10.72 117.47,13.52 P15.1 ; 120.27,10.72 CN9.1
GND: length 43.7
  Top Layer w0.254: U3.16 58.18,43.62 59.18,44.62 U3.21 58.55,44.76 58.04,44.25 57.31,44.26 ; v3(62.48,7.06) 61.96,7.06 61.58,7.44 60.51,7.44 ; R61.1 R62.1 R63.1 50.48,46.35 49.98,46.85 v3(49.02,46.85) ; TP5.1 60.32,1.71 61.91,3.3 C14.2 ; v1(96.89,44.19) 100.52,44.19 100.72,43.99 U9.8 ; R45.1 124.71,41.08 124.33,40.7 R47.1 ; v3(9.14,13.52) 6.35,13.52 5.97,13.14 U12.2 ; v3(102.24,16.44) 102.24,13.26 101.64,12.67 U6.4
  Top Layer w0.7: PWR1.4 6.98,36.89 7.82,36.05 v2(8.84,36.05) v1(11.35,36.05)
  vias: v1(54.55,43.11) v1(56.26,39.43) v1(56.26,38.54) v1(56.77,37.65) v1(57.02,39.43) v1(57.02,38.54) v1(87.76,45.28) v1(89.66,45.65) v1(89.66,44.89) v1(89.66,44.12) v1(89.66,43.24) v1(102.02,43.36) v1(111.76,26.03) v1(113.79,26.47) v1(124.71,25.01) v1(125.12,49.08) v1(130.04,55.49) v1(133.99,49.33) v1(133.99,48.06) v1(133.99,47.17) v1(134.87,47.17) v1(135.76,53.14) v1(136.08,41.2) v1(136.14,26.47) v1(136.14,25.46) v1(137.29,26.47) v1(137.29,25.46) v1(138.43,26.47) v1(138.43,25.46) v1(139.45,26.47) v1(139.45,25.46) v1(140.53,22.03) v1(141.67,29.53) v2(1.78,18.47) v2(1.91,22.79) v2(1.91,7.8) v2(2.03,36.38) v2(4.7,30.28) v2(4.7,8.31) v2(4.83,26.34) v2(4.83,22.92) v2(5.21,36.25) v2(7.87,1.58) v2(9.4,26.47) v2(9.53,30.41) v2(9.65,33.2) v2(11.3,1.33) v2(11.81,11.23) v2(12.06,15.04) v2(12.32,21.52) v2(12.32,18.72) v2(14.73,2.22) v2(14.99,11.23) v2(18.03,26.85) v2(20.95,26.73) v2(23.24,34.09) v2(23.37,37.65) v2(23.5,27.11) v2(26.03,53.27) v2(26.16,56.95) v2(30.61,58.09) v2(30.73,55.94) v2(30.73,53.78) v2(32.26,28.25) v2(32.39,41.46) v2(33.27,50.6) v2(34.42,17.2) v2(34.67,14.03) v2(34.67,10.72) v2(34.92,7.29) v2(36.32,41.33) v2(36.96,50.6) v2(37.21,14.41) v2(37.34,10.85) v2(37.47,38.66) v2(37.47,17.45) v2(37.59,7.55) v2(38.23,43.11) v2(40.26,14.15) v2(40.26,7.29) v2(40.39,40.7) v2(40.39,10.72) v2(40.51,17.33) v2(40.64,35.87) v2(40.89,50.6) v2(41.53,47.05) v2(43.05,58.48) v2(43.05,56.19) v2(43.94,6.53) v2(46.99,6.53) v2(47.5,57.21) v2(49.78,6.53) v2(49.91,9.96) v2(50.04,16.06) v2(50.17,13.14) v2(53.72,16.06) v2(53.85,13.39) v2(54.61,38.28) v2(57.02,23.42) v2(59.82,54.79) v2(59.94,23.42) v2(62.87,54.79) v2(62.87,52.89) v2(62.87,50.6) v2(62.87,23.42) v2(63.63,15.8) v2(63.63,12.63) v2(63.88,30.28) v2(64.01,26.98) v2(64.13,3.61) v2(65.91,23.42) v2(66.55,12.38) v2(66.68,15.93) v2(66.93,3.49) v2(67.18,28.63) v2(68.71,39.81) v2(68.71,38.16) v2(69.34,23.3) v2(69.98,51.62) v2(69.98,26.85) v2(70.23,30.28) v2(72.14,53.78) v2(72.14,9.07) v2(72.39,15.68) v2(72.77,3.36) v2(73.41,50.6) v2(73.41,47.3) v2(73.41,44.12) v2(73.91,36.25) v2(74.04,39.55) v2(74.17,56.57) v2(75.18,53.78) v2(76.07,3.36) v2(76.96,38.03) v2(78.99,46.92) v2(79.12,3.36) v2(79.25,16.06) v2(79.5,9.33) v2(79.88,49.97) v2(80.01,22.92) v2(80.26,53.4) v2(80.26,39.81) v2(80.26,36.12) v2(81.41,16.06) v2(81.41,9.33) v2(81.66,3.49) v2(81.91,47.05) v2(82.3,50.09) v2(82.55,53.27) v2(82.8,22.92) v2(83.69,38.03) v2(83.95,16.06) v2(83.95,9.33) v2(84.71,3.49) v2(85.72,36) v2(85.98,40.82) v2(87.63,3.36) v2(88.52,39.05) v2(90.42,41.08) v2(90.42,28) v2(90.68,3.49) v2(90.81,15.93) v2(90.93,9.45) v2(91.19,22.92) v2(92.33,26.47) v2(92.71,21.52) v2(93.47,52) v2(95,41.08) v2(95.63,5.52) v2(95.63,3.36) v2(96.27,15.8) v2(96.39,20.38) v2(97.54,58.22) v2(97.79,55.05) v2(97.92,50.22) v2(98.68,41.08) v2(98.81,3.36) v2(99.44,52.63) v2(99.69,58.09) v2(100.71,50.22) v2(101.09,24.82) v2(101.22,33.08) v2(101.47,54.92) v2(102.62,58.09) v2(102.62,26.22) v2(103,13.64) v2(103.5,40.06) v2(107.19,41.08) v2(107.31,43.62) v2(107.7,19.49) v2(107.7,17.71) v2(109.98,36.38) v2(110.74,44) v2(111.12,40.06) v2(112.01,19.61) v2(112.01,17.71) v2(113.41,37.52) v2(113.66,42.35) v2(113.79,46.67) v2(115.82,53.65) v2(115.82,51.75) v2(115.82,39.93) v2(116.46,44.51) v2(116.71,30.66) v2(116.84,25.71) v2(118.24,42.09) v2(118.24,37.39) v2(118.49,28.25) v2(119.13,46.67) v2(119.38,53.78) v2(120.14,25.71) v2(120.52,30.54) v2(122.3,18.22) v2(122.3,15.8) v2(122.56,54.54) v2(122.81,36.89) v2(124.08,22.03) v2(124.33,39.17) v2(124.71,30.66) v2(125.48,54.54) v2(126.75,22.15) v2(127.63,54.54) v2(128.52,40.95) v2(128.65,57.08) v2(129.29,17.96) v2(129.41,26.22) v2(129.92,30.54) v2(130.56,38.92) v2(130.81,20.25) v2(131.32,15.8) v2(131.7,57.08) v2(131.7,26.34) v2(132.97,2.34) v2(133.22,18.09) v2(133.99,42.73) v2(133.99,26.34) v2(134.11,51.49) v2(134.11,40.06) v2(134.11,30.54) v2(134.24,37.27) v2(135.25,20.25) v2(137.41,17.96) v2(137.54,2.34) v2(137.67,51.49) v2(138.94,56.95) v2(139.45,43.11) v2(139.57,38.92) v2(139.57,32.19) v2(139.83,35.74) v2(140.59,20) v2(141.22,51.36) v2(141.22,5.64) v2(141.6,8.44) v2(141.6,2.09) v2(141.73,41.08) v2(141.99,37.65) v2(141.99,34.09) v2(142.75,58.48) v2(144.02,39.05) v2(144.15,35.74) v2(144.27,33.08) v2(144.4,52.13) v2(144.65,20.12) v2(144.78,8.95) v2(144.91,16.57) v2(144.91,13.14) v2(146.05,1.96) v2(147.45,57.71) v2(148.08,40.82) v2(148.21,53.78) v2(148.21,50.22) v2(148.21,20.12) v2(148.34,46.54) v2(148.34,7.93) v2(148.46,4.63) v3(2.79,12.88) v3(2.79,10.6) v3(4.84,19.49) v3(5.4,17.33) v3(14.73,19.36) v3(14.73,18.47) v3(14.73,17.58) v3(14.73,16.57) v3(14.86,15.04) v3(15.75,19.36) v3(15.75,18.47) v3(15.75,17.58) v3(15.75,16.57) v3(16.76,18.47) v3(16.76,17.58) v3(16.76,16.57) v3(18.92,36) v3(18.92,32.19) v3(19.05,33.97) v3(24.89,6.53) v3(29.46,4.63) v3(52.58,11.23) v3(52.58,10.09) v3(52.58,8.95) v3(52.58,7.93) v3(52.58,6.91) v3(53.74,11.23) v3(53.74,8.95) v3(53.72,7.93) v3(53.85,10.09) v3(53.85,7.04) v3(58.67,45.39) v3(58.67,44.25) v3(58.67,10.85) v3(58.67,9.84) v3(58.67,8.95) v3(58.67,7.93) v3(58.67,7.04) v3(58.67,6.03) v3(59.44,10.85) v3(59.44,9.84) v3(59.44,8.95) v3(59.44,7.93) v3(59.44,7.04) v3(59.44,6.03) v3(59.69,45.39) v3(59.69,44.25) v3(62.48,5.9) v3(62.48,5.01) v3(63.63,7.04) v3(63.63,5.9) v3(63.63,5.01) v3(64.77,7.06) v3(64.77,5.9) v3(64.77,5.01) v3(65.91,7.04) v3(65.91,5.9) v3(65.91,5.01) v3(67.06,7.04) v3(67.06,5.9) v3(67.06,5.01) v3(90.93,47.12) v3(91.06,34.86) v3(92.96,34.86) v3(94.87,34.86) v3(95.76,7.95) v3(97.79,18.72) v3(102.24,17.33) v3(103.25,16.44) v3(103.38,17.33) v3(103.5,52.25) v3(103.5,49.71) v3(104.52,17.33) v3(104.58,46.28) v3(104.58,16.57) v3(104.78,58.33) v3(108.08,15.42) v3(108.27,38.54) v3(110.36,15.41) v3(115.84,11.63) v3(115.84,10.49) v3(117.11,11.63) v3(117.11,10.49) v3(120.9,49.52) v3(122.82,9.72) v3(122.82,7.55) v3(125.6,11.61) v3(125.6,10.47) v3(126.87,11.61) v3(126.87,10.47) v3(132.59,9.71) v3(132.59,7.55) v4(109.92,48.19)
VBAT: length 154.2
  Top Layer w0.6: U12.3 6.92,9.52 8.64,7.8 8.64,4.37 9.53,3.49 12.45,3.49 13.08,4.12 13.07,5.5
  Top Layer w0.7: 17.14,7.55 19.81,10.22 R34.2 ; 17.14,7.55 13.97,7.55 13.07,6.65 13.07,5.5 ; 17.14,7.55 18.92,7.55 19.27,7.2 CN11.1
  Bottom Layer w0.2: v3(109.85,26.47) 109.85,17.84 109.47,17.45 v3(109.47,10.47)
  Bottom Layer w1.5: v3(111.25,7.42) 110.36,6.53 110.36,2.34 109.35,1.33 52.32,1.33 52.32,1.71 ; 52.32,1.71 55.75,5.14 v3(55.75,8.69) ; 52.32,1.71 v3(36.96,1.71) 21.21,1.71 19.27,3.65 CN11.1
  vias: v3(55.75,11.36) v3(55.75,10.47) v3(55.75,9.58) v3(56.77,8.69) v3(109.47,9.07) v3(109.47,7.42) v3(109.47,5.64) v3(109.47,3.74) v3(111.25,10.47) v3(111.25,9.07) v3(111.25,5.64) v3(111.25,3.74)
VBAT_NEG: length 54
  Top Layer w0.254: v3(42.55,3.61) 43.43,3.61 43.69,3.36 TP3.1
  Top Layer w0.7: Q5.2 22.11,15.92 v3(22.22,15.8) ; v3(17.65,11.68) v3(17.65,10.88) v3(17.65,9.96) 16.38,8.69 12.06,8.69 10.53,7.16 CN12.2
  Bottom Layer w0.254: v3(22.22,14.92) 22.22,5.39 24,3.61 v3(42.55,3.61)
  Bottom Layer w0.7: v3(21.08,14.92) 19.18,14.92 17.65,13.39 v3(17.65,11.68)
  vias: v3(21.08,15.8)
AUX1: length 57.8
  Top Layer w0.2: 136.4,35.21 135.79,34.6 v3(134.62,34.6)
  Top Layer w0.254: 137.03,43.5 137.03,40.19 136.4,39.55 136.4,34.35 135.51,33.46 113.92,33.46 112.78,32.31 112.78,29.77 111.25,28.25 107.57,28.25 107.14,27.82 S1.1
  Bottom Layer w0.2: v3(126.62,38.92) 126.62,35.23 127.25,34.6 v3(134.62,34.6)
AUX2: length 54
  Top Layer w0.2: 132.34,37.01 132.21,37.14 TP11.1
  Top Layer w0.254: S1.3 111.12,29.39 112.01,30.28 112.01,32.69 113.54,34.22 131.06,34.22 132.34,35.5 132.34,54.54
AUX3: length 32
  Top Layer w0.254: 119.89,34.98 120.9,36 120.9,41.97 121.53,42.6 R47.2 R46.1 ; 119.89,34.98 113.16,34.98 110.11,31.93 S1.5 ; 119.89,34.98 123.95,34.98 124.33,35.36 TP12.1
AUX_SIG: length 41.9
  Top Layer w0.2: R42.3 117.86,56.83 119.51,58.48 140.34,58.48 141.1,57.71 141.1,53.27 140.66,52.83 D4.1
  Top Layer w0.254: P1.4 P1.3 142.24,49.33 R24.2 D4.1
BAT: length 17.8
  Top Layer w0.254: R53.1 104.9,24.57 103.89,25.58 103.89,33.2 105.16,34.47 S1.7
BUTTON_SIG: length 49.2
  Top Layer w0.254: R64.1 R65.2 27.18,7.8 25.4,9.58 25.4,49.71 26.54,50.86 27.87,50.86 U5.4
BUZZER1_2: length 17.9
  Top Layer w1: 84.16,45.27 84.16,49.17 85.09,50.09 BUZZER1.2
  Bottom Layer w1: BUZZER1.2 90.42,53.27 91.95,54.79 CN14.1
C14_1: length 11.6
  Top Layer w0.254: 60.51,6.94 60.51,5.01 60.51,3.8 60.32,3.61 56.9,3.61 56.64,3.87 56.64,7.17 56.91,7.44 57.6,7.44
C24_2: length 4.1
  Top Layer w0.254: U11.2 R34.1 17.72,13.14 C24.2
C34_-: length 18.3
  Top Layer w0.5: P2.3 127.57,50.03 U14.3 ; P2.3 127.63,51.49 126.87,52.25 119,52.25 118.11,51.37 C34.- ; P2.3 P2.4
C37_2: length 15.2
  Top Layer w0.2: C37.2 124.78,26.47 U15.2 ; P15.3 P15.4
  Top Layer w0.254: P15.4 121.67,19.74 122.43,20.5 122.43,25.58 123.25,26.41 C37.2
CN1_1: length 16.7
  Top Layer w0.2: TP9.1 69.22,49.97 67.69,49.97 67.31,49.59 67.31,48.57 66.93,48.19 R5.1
  Top Layer w0.254: CN1.1 70.74,55.17 66.42,50.86 R5.1
CN3_2: length 4.3
  Top Layer w0.254: P1.2 CN3.2
CN3_3: length 4.3
  Top Layer w0.254: P1.1 CN3.3
CN9_2: length 3.4
  Top Layer w1.2: Q2.3 117.73,5.52
CN10_2: length 3.4
  Top Layer w1.2: Q3.3 CN10.2
D4_3: length 3.6
  Top Layer w0.254: R22.2 137.03,55.94 137.53,55.44 D4.3
D5_1: length 34.2
  Top Layer w0.254: D2.1 31.37,1.83 32.64,0.56 49.28,0.56 49.91,1.2 49.91,2.09 50.67,2.85 54.23,2.85 54.86,3.49 54.86,5.77 55.25,6.15 55.5,6.15 55.75,6.41 R29.1 55.75,7.68 56.02,7.94 U7.12
I2C0_SCL: length 64.6
  Top Layer w0.254: U5.27 46.64,25.43 47.62,24.44 47.62,22.66 48.64,21.65 76.45,21.65 77.85,20.25 86.52,20.25 P5.3 P6.3 P7.3
  Bottom Layer w0.254: 88.26,23.55 P5.3
I2C0_SDA: length 59.9
  Top Layer w0.254: P7.2 P6.2 P5.2 85.7,18.5 84.58,19.61 77.47,19.61 76.07,21.01 47.56,21.01 U5.26
  Bottom Layer w0.254: P9.1 P5.2
I2C1_SCL: length 50.4
  Top Layer w0.254: U5.25 75.42,20.35 P12.3 P13.3 P14.3
  Bottom Layer w0.254: P12.3 77.22,18.55 P10.2
I2C1_SDA: length 48.4
  Top Layer w0.254: P14.2 P13.2 P12.2 74.73,18.54 73.66,19.61 50.04,19.61 48.26,17.84 45.71,17.84 U5.24
  Bottom Layer w0.254: P12.2 74.68,18.55 P10.1
MCP_CHRG: length 53.3
  Bottom Layer w0.2: U5.7 27.87,43.24 26.67,43.24 26.03,42.6 26.03,24.69 24.64,23.3 10.67,23.3 9.65,22.28 9.65,11.99 8.25,10.6 v1(4.69,10.6)
MUX_A: length 85.4
  Top Layer w0.254: U9.11 102.02,38.75 101.22,39.55 92.84,39.55 91.06,37.78 v3(91.06,36.76)
  Bottom Layer w0.254: U5.14 27.92,25.46 38.99,25.46 40.39,26.85 40.39,30.54 41.53,31.68 47.24,31.68 48.77,33.2 87.76,33.2 88.39,33.84 88.39,35.74 89.41,36.76 v3(91.06,36.76)
MUX_B: length 85.6
  Top Layer w0.254: U9.10 101.36,38.4 100.97,38.79 93.6,38.79 92.96,38.16 v3(92.96,36.76)
  Bottom Layer w0.254: v3(92.96,36.76) 92.96,36.12 92.58,35.74 89.92,35.74 89.15,34.98 89.15,33.2 88.39,32.44 50.04,32.44 46.86,29.27 43.94,29.27 42.42,27.74 42.42,23.93 41.4,22.92 27.92,22.92 U5.15
MUX_C: length 90.7
  Top Layer w0.254: v3(94.87,36.76) 97.03,36.76 97.79,37.52 U9.9
  Bottom Layer w0.254: U5.16 27.93,20.38 42.67,20.38 43.56,21.27 43.56,25.71 44.45,26.6 48.26,26.6 49.15,27.49 49.15,30.28 50.55,31.68 96.39,31.68 97.03,32.31 97.03,36.12 96.39,36.76 v3(94.87,36.76)
P2_2: length 4.3
  Top Layer w0.5: P2.2 CN5.1
P9_3: length 2.5
  Top Layer w0.254: R58.2 P9.3
P9_4: length 2.5
  Top Layer w0.254: R57.2 88.26,26.09
PICO_AUX: length 74
  Top Layer w0.254: U9.3 103.95,42.54 103.5,42.09 99.69,42.09 99.19,42.59 D8.3 95,43.24 86.23,34.47 50.04,34.47 47.62,36.89 44.58,36.89 43.81,37.65 43.81,42.6 44.42,43.21 U5.34
PICO_BPM_AN: length 126.4
  Top Layer w0.254: 139.15,24.62 140.14,24.62 140.72,25.2 140.72,27.23 ; TP14.1 146.3,36.3 146.3,31.55 145.41,30.66 141.22,30.66 140.72,30.16 D9.3 140.08,27.87 123.95,27.87 121.92,25.84 121.92,23.68 121.54,23.3 99.82,23.3 97.28,25.84 97.28,30.54 94.62,33.2 49.53,33.2 47.14,35.59 U5.31
PICO_BPM_BTN: length 125
  Top Layer w0.254: v1(35.18,35.62) 35.94,35.62 37.34,34.22 47.12,34.22 48.89,32.44 94.23,32.44 96.39,30.28 96.39,25.33 99.19,22.53 114.68,22.53 116.21,21.01 116.21,14.66 116.84,14.03 133.99,14.03 134.37,14.41 134.37,15.3 134.87,15.8 R49.2
  Bottom Layer w0.2: U5.10 35.15,35.59 v1(35.18,35.62)
PICO_BPM_PUMP: length 114.9
  Top Layer w0.254: 120.54,11.63 120.54,12.74 120.01,13.26 115.95,13.26 115.19,14.03 115.19,19.49 113.54,21.14 97.66,21.14 94.36,24.44 94.36,28.38 93.22,29.52 72.64,29.52 71.5,28.38 71.5,26.09 70.74,25.33 50.42,25.33 48.77,26.98 48.77,28.12 47.75,29.14 36.19,29.14 35.18,30.16 v1(35.18,33.08)
  Bottom Layer w0.2: v1(35.18,33.08) 35.15,33.05 U5.11
PICO_BPM_PWR: length 92.7
  Top Layer w0.254: 100.07,13.32 99.13,13.32 98.93,13.52 95.88,13.52 95,14.41 95,22.03 92.2,24.82 49.02,24.82 47.24,26.6 34.92,26.6 33.91,27.61 33.91,37.52 33.27,38.16 v1(32.77,38.16)
  Bottom Layer w0.2: U5.9 32.74,38.13 v1(32.77,38.16)
PICO_BPM_VALVE: length 118.5
  Top Layer w0.254: R55.2 130.43,12.88 129.67,13.64 116.33,13.64 115.7,14.28 115.7,20.25 114.17,21.77 98.68,21.77 95.5,24.95 95.5,29.9 93.73,31.68 v1(36.45,31.68)
  Bottom Layer w0.2: v1(36.45,31.68) 32.26,31.68 31.09,30.51 U5.12
PICO_BUZZ: length 101.1
  Top Layer w0.254: U5.20 27.92,10.22 29.59,10.22 30.48,11.1 30.48,43.62 31.24,44.38 47.12,44.38 47.75,43.74 47.75,38.92 50.8,35.87 69.85,35.87 71.37,37.39 71.37,40.31 72.26,41.2 83.44,41.2 83.95,41.72 R15.2
PICO_EBT: length 7
  Top Layer w0.254: P4.1 50.67,29.14 49.3,30.51 U5.29
PICO_ECG_AN: length 44.6
  Top Layer w0.2: TP6.1 48.77,53.4 50.93,55.56 50.93,57.59 51.69,58.35 56.9,58.35 57.28,57.97 CN4.3
  Bottom Layer w0.2: CN4.3 57.27,51.99 55.88,50.6 55.88,48.7 56.39,48.19 v1(57.02,48.19) 52.83,48.19 51.31,46.67 51.31,39.3 50.14,38.13 U5.32
PICO_ECG_LN: length 80.7
  Top Layer w0.2: CN4.4 54.74,55.3 51.94,52.51 51.94,46.16 52.38,45.72 R63.2
  Top Layer w0.254: U9.5 102.65,44.47 101.47,45.65 96.27,45.65 94.87,47.05 v3(94.87,56.06) ; U3.11 53.7,45.76 52.9,44.95 R63.2
  Bottom Layer w0.254: CN4.4 54.73,57.96 55.12,58.35 94.11,58.35 94.87,57.59 v3(94.87,56.06)
PICO_ECG_LP: length 89.2
  Top Layer w0.2: CN4.5 52.19,53.39 51.44,52.63 51.44,43.24 51.75,42.92 R62.2
  Top Layer w0.254: U3.12 54.09,45.26 52.38,43.55 R62.2 ; U9.1 105.27,44.24 104.9,44.63 103.63,44.63 101.85,46.41 96.9,46.41 95.88,47.43 v3(95.88,56.06)
  Bottom Layer w0.254: v3(95.88,56.06) 95.88,57.84 94.74,58.98 52.83,58.98 52.19,58.34 CN4.5
PICO_ECG_SIG: length 99.1
  Top Layer w0.2: v3(30.35,47.05) 30.35,50.98 32.51,53.14 42.67,53.14 44.07,54.54 48.51,54.54 49.66,55.68 CN4.6
  Top Layer w0.254: v3(52.38,40.89) 53.15,40.89 53.59,41.33 53.59,43.74 54.61,44.76 57.31,44.76 ; U5.17 27.08,17.81 26.54,18.34 26.54,46.54 27.05,47.05 v3(30.35,47.05)
  Bottom Layer w0.2: v3(52.38,40.89) 52.38,38.72 50.67,37.01 44.07,37.01 42.29,38.79 42.29,41.84 37.08,47.05 v3(30.35,47.05)
PICO_ENA: length 25.6
  Bottom Layer w0.254: P4.3 55.75,25.84 54.36,24.44 49.15,24.44 47.88,23.17 47.88,10.98 47.12,10.22 45.71,10.22 U5.21
PICO_ENB: length 20.2
  Bottom Layer w0.254: P4.2 53.21,25.96 52.2,24.95 48.64,24.95 47.37,23.68 47.37,14.42 U5.22
PICO_LED: length 96.5
  Top Layer w0.254: CN13.2 78.87,42.73 77.98,41.84 71.88,41.84 70.61,40.57 70.61,37.39 69.72,36.5 51.18,36.5 48.51,39.17 48.51,44.89 46.48,46.92 44.83,46.92 42.93,45.01 30.86,45.01 29.72,43.87 29.72,13.52 28.96,12.76 27.92,12.76 U5.19
POWER_LATCH: length 47.8
  Top Layer w0.254: R28.1 31.88,7.55 31.11,8.31 27.56,8.31 26.03,9.84 26.03,47.68 26.67,48.32 27.87,48.32 U5.5
Q5_1: length 1.5
  Top Layer w0.254: U11.4 20.76,18.76 Q5.1
Q6_1: length 1.5
  Top Layer w0.254: Q6.1 18.86,18.81 U11.5
R1_1: length 17.1
  Top Layer w0.2: v1(66.42,44.38) R3.1 TP7.1
  Bottom Layer w0.2: v1(66.42,44.38) 66.42,47.94 65.66,48.7 CN1.3
R2_1: length 16.8
  Top Layer w0.2: TP8.1 R4.1 66.55,46.41 R2.1 65.79,46.28 65.53,46.54 65.53,51.49 68.2,54.16 CN1.2
R16_2: length 4.1
  Top Layer w0.254: CN2.1 14.61,30.66 14.22,31.04 R16.2
R17_2: length 4
  Top Layer w0.254: R17.2 12.32,30.92 12.06,30.66 CN2.2
R18_1: length 5.1
  Top Layer w0.254: R18.1 15.37,49.97 17.27,51.87 17.25,53.14
R19_1: length 8.6
  Top Layer w0.254: USB1.3 16,53.9 16,52.38 15.24,51.62 12.95,51.62 12.32,50.98 R19.1
R28_2: length 4.4
  Top Layer w0.254: R28.2 31.88,2.72 32.77,1.83 D2.2
R30_2: length 1.9
  Top Layer w0.254: R30.2 57.65,6.89 U7.14
R31_2: length 15.8
  Top Layer w0.254: R65.1 R31.2 23.75,4.63 23.45,4.33 D5.2 18.42,1.83 16.73,3.52 CN11.2
R35_2: length 2.1
  Top Layer w0.254: U11.1 R35.2
R38_1: length 2.2
  Top Layer w0.254: R38.1 100.14,18.79 C25.2
R43_2: length 20.7
  Top Layer w0.254: 106.93,58.33 108.09,58.33 108.71,57.71 108.71,56.32 109.47,55.56 118.87,55.56 119.38,56.06 119.38,57.33 120.01,57.97 122.3,57.97 R43.2
R44_1: length 2.1
  Top Layer w0.254: 105.98,46.28 R44.1
R45_2: length 5
  Top Layer w0.5: P2.1 127.63,45.78 126.83,44.97 R45.2
R50_1: length 6.2
  Top Layer w0.254: Q2.1 118.72,10.53 119.52,9.72 R50.1 120.54,10.36 120.92,10.74 122.44,10.74 122.82,11.12 R51.2
R54_2: length 6.4
  Top Layer w0.254: Q3.1 128.96,9.71 R55.1 130.43,10.34 130.68,10.6 132.33,10.6 132.59,10.85 R54.2
R59_2: length 2.5
  Top Layer w0.254: R59.2 P10.3
R60_2: length 2.5
  Top Layer w0.254: R60.2 P10.4
SIG_CHARGE: length 45
  Bottom Layer w0.2: U5.6 27.87,45.78 26.29,45.78 25.4,44.89 25.4,24.95 24.26,23.81 10.41,23.81 9.14,22.53 v1(9.14,17.58)
U3_1: length 4.2
  Top Layer w0.2: U3.1 62.98,43.76 63.37,43.36 63.37,42.86 63.75,42.47 C3.1
U3_2: length 3.5
  Top Layer w0.2: U3.2 62.75,44.26 62.87,44.38 R1.2
U3_3: length 4.3
  Top Layer w0.2: R2.2 63.63,46.28 63.25,45.9 63.25,45.52 62.48,44.76 U3.3
U3_4: length 2.7
  Top Layer w0.2: C4.2 62.48,45.65 62.09,45.26 U3.4
U3_5: length 5.5
  Top Layer w0.2: R5.2 62.55,48.19 C4.1 61.66,48.13 61.05,47.52 U3.5
U3_6: length 15.5
  Top Layer w0.254: U3.6 60.18,47.28 60.39,47.49 v1(60.39,48.19)
  Bottom Layer w0.2: v1(66.42,39.43) 66.42,40.7 65.79,41.33 61.34,41.33 60.96,41.71 60.96,46.03 60.39,46.6 v1(60.39,48.19)
U3_7: length 13.1
  Top Layer w0.2: U3.7 59.68,49.96 59.82,50.09 C6.1
  Top Layer w0.254: R12.1 54.99,52.76 55.25,53.02 60.07,53.02 60.39,52.7 C6.1
U3_8: length 1.6
  Top Layer w0.254: C5.2 58.99,47.49 59.18,47.3 U3.8
U3_9: length 4.6
  Bottom Layer w0.2: v3(57.02,50.09) 57.78,50.09 58.67,49.2 v1(58.68,46.63)
U3_18: length 2.3
  Top Layer w0.2: R13.2 58.93,41.33 59.18,41.58 U3.18
U3_19: length 14.7
  Top Layer w0.2: v1(60.45,41.33) 59.82,41.33 59.68,41.47 U3.19
  Bottom Layer w0.2: v1(52.96,46.92) 57.14,46.92 57.91,46.16 60.07,46.16 60.45,45.78 v1(60.45,41.33)
U3_20: length 7.9
  Top Layer w0.2: U3.20 61.94,42.89 62.48,42.35 R8.1 65.53,41.33 65.85,41.65 C3.2
U4_6: length 2.7
  Top Layer w0.254: R18.2 14.22,47.17 13.89,46.84 U4.6
U4_7: length 2.6
  Top Layer w0.254: U4.7 12.62,46.74 12.32,47.05 R19.2
U4_10: length 2.5
  Top Layer w0.254: R17.1 12.32,34.47 12.62,34.78 U4.10
U4_11: length 2.5
  Top Layer w0.254: R16.1 14.22,34.47 13.89,34.8 U4.11
U6_1: length 2.2
  Top Layer w0.254: R38.2 100.07,14.62
U6_2: length 5.1
  Top Layer w0.254: R26.2 R27.1 98.43,14.53 98.55,14.41 98.55,13.97 U6.2
U6_8: length 2
  Top Layer w0.254: 105.98,16.57 105.98,14.68 U6.8
U9_12: length 12.8
  Top Layer w0.254: 98.86,31.93 97.28,31.93 96.27,32.95 96.27,34.47 97.28,35.49 101.73,35.49 102.65,36.42 U9.12
U9_13: length 13.7
  Bottom Layer w0.2: v3(98.86,26.85) 100.84,26.85 101.98,28 101.98,30.66 103.31,32 v1(103.31,37.52)
U9_14: length 13
  Top Layer w0.2: 98.86,29.39 v3(102.62,29.39)
  Bottom Layer w0.2: v3(102.62,29.39) 103.5,29.39 103.95,29.84 v1(103.95,37.52)
U9_15: length 7.8
  Top Layer w0.254: U9.15 104.61,36.21 102.87,34.47 98.86,34.47
U13_1: length 20.1
  Top Layer w0.254: U13.1 103.5,54.41 104.14,55.05 120.4,55.05 120.94,55.6 R43.1
U13_3: length 14.2
  Bottom Layer w0.2: v3(103.5,50.98) 111,50.98 113.16,53.14 113.16,56.83
U13_5: length 7.8
  Top Layer w0.254: R44.2 111,46.28 112.01,47.3 C34.+
  Top Layer w0.5: U13.5 C34.+
U13_7: length 7.2
  Bottom Layer w0.2: 109.1,52.25 106.81,52.25 104.78,54.28 v3(104.78,56.33)
  vias: v3(109.1,52.25)
U13_8: length 4.5
  Bottom Layer w0.2: v3(106.93,56.33) 106.93,54.28 107.7,53.52 v3(109.1,53.52)
U14_4: length 7.8
  Top Layer w0.254: R46.2 124.33,46.41 125.12,47.2 U14.1 124.27,48.13 123.82,48.57 123.82,49.33 123.13,50.03 U14.4
U15_1: length 34.3
  Top Layer w0.254: TP16.1 146.94,34.44 146.94,31.17 145.8,30.03 144.4,30.03 142.49,28.12 142.49,24.19 142.71,23.97 143.55,23.97 ; U15.1 v1(136.5,28.97)
  Bottom Layer w0.2: v1(136.5,28.97) 138.55,28.97 v1(143.55,23.97)
U15_3: length 31.2
  Top Layer w0.254: TP15.1 148,31.22 146.3,29.52 144.65,29.52 143.55,28.42 143.55,25.92
  Bottom Layer w0.2: v1(143.55,25.92) 144.78,24.69 144.78,23.68 144.15,23.04 142.62,23.04 141.69,23.97 v1(126.9,23.97)
U16_2: length 3.9
  Top Layer w0.254: 143.55,24.62 145.72,24.62 R48.2
U16_3: length 5.9
  Top Layer w0.254: 143.55,25.27 144.72,25.27 145.29,25.84 145.29,28 145.63,28.34 R48.1
U16_8: length 17.4
  Top Layer w0.2: U16.8 139.13,22.03
  Top Layer w0.254: P3.3 P3.4 129.41,22.03 C38.1
U17_1: length 16.8
  Top Layer w0.254: R49.1 138.94,15.8 140.21,17.07 141.86,17.07 142.49,16.44 142.49,11.36 143.13,10.72 U17.1
U17_4: length 14.1
  Top Layer w0.254: CN8.2 CN7.2 135.76,12.03 135.76,13.39 136.65,14.28 139.42,14.28 U17.4
U17_5: length 10
  Top Layer w0.254: CN8.1 CN7.1 138.27,12.6 138.94,13.26 U17.5
USB_GND: length 6.1
  Top Layer w0.254: PWR1.2 10.67,43.36 11.36,44.05 v3(11.36,45.55)
  vias: v3(19.11,49.71) v3(19.11,47.94)

## Copper pours and planes (outline as drawn; the poured copper is in the pictures)
3V3 on Top Layer: 60.2,10.47 67.82,10.47 67.82,7.8 60.2,7.8
3V3 on Top Layer: 55.5,43.87 57.78,43.87 57.78,40.82 55.5,40.82
3V3 on Top Layer: 14.86,37.27 18.03,37.27 18.03,33.46 14.86,33.46
3V3 on Top Layer: 19.94,37.27 21.21,37.27 21.21,31.68 19.94,31.68
3V3 on 3V3: 25.27,61.52 25.27,39.17 -0.89,39.17 -0.89,-6.8 -1.91,-7.82 145.54,-7.82 154.94,1.58 154.94,61.14 152.91,63.17 27.56,63.17 26.8,62.41
5V on Top Layer: 87,48.06 90.3,48.06 90.3,46.54 87,46.54
5V_SAFE on Top Layer: 6.1,20.25 7.62,20.25 7.62,14.15 6.1,14.15
5V_SAFE on Top Layer: 6.1,20.25 9.65,20.25 9.65,18.6 6.1,18.6
5V_USB on Top Layer: 19.94,50.22 21.34,50.22 21.34,44.25 19.94,44.25
5V_USB on 3V3: -0.64,42.35 22.22,42.35 22.99,43.11 22.99,60.89 -0.76,60.89 -0.89,60.76
6V on Top Layer: 94.87,13.14 98.68,13.14 98.68,9.07 94.87,9.07
6V on Top Layer: 90.93,47.68 92.46,47.68 92.46,44.51 90.93,44.51
GND on Top Layer: 107.19,16.19 111.12,16.19 111.12,14.66 107.19,14.66
GND on Top Layer: 85.34,46.16 90.17,46.16 90.17,42.6 85.34,42.6
GND on Top Layer: 25.15,64.95 25.15,39.17 -2.67,39.17 -2.92,39.43 -2.92,-2.48 -3.56,-3.12 157.73,-3.12 159.64,-1.21 159.64,61.02 154.94,65.72
GND on Top Layer: 122.06,10.23 123.59,10.23 123.59,6.8 122.06,6.8
GND on Top Layer: 133.48,49.84 135.38,49.84 135.38,46.67 133.48,46.67
GND on Top Layer: 4.06,20.25 5.84,20.25 5.84,16.82 4.06,16.82
GND on Top Layer: 18.54,37.27 19.43,37.27 19.43,31.68 18.54,31.68
GND on Top Layer: 89.15,44.12 92.46,44.12 92.46,42.47 89.15,42.47
GND on Top Layer: 58.17,11.23 59.94,11.23 59.94,5.64 58.17,5.64
GND on Top Layer: 14.22,19.87 17.65,19.87 17.65,14.41 14.22,14.41
GND on Top Layer: 111.25,27.11 114.43,27.11 114.43,25.58 111.25,25.58
GND on Top Layer: 125.09,12.12 127.38,12.12 127.38,9.96 125.09,9.96
GND on Top Layer: 61.34,7.8 67.82,7.8 67.82,4.5 61.34,4.5
GND on Top Layer: 101.6,17.84 105.16,17.84 105.16,15.93 101.6,15.93
GND on Top Layer: 52.07,11.99 54.48,11.99 54.48,6.15 52.07,6.15
GND on Top Layer: 2.29,13.39 3.3,13.39 3.3,10.09 2.29,10.09
GND on Top Layer: 55.88,39.93 57.28,39.93 57.28,37.14 55.88,37.14
GND on Top Layer: 123.82,44.25 128.65,44.25 128.65,41.46 123.82,41.46
GND on Top Layer: 115.33,12.14 117.62,12.14 117.62,9.98 115.33,9.98
GND on Top Layer: 135.51,27.11 139.95,27.11 139.95,25.08 135.51,25.08
GND on Top Layer: 90.55,35.37 95.38,35.37 95.38,34.35 90.55,34.35
GND on Top Layer: 131.83,10.22 133.35,10.22 133.35,6.79 131.83,6.79
GND on Bottom Layer: 25.15,64.44 25.15,39.17 -2.79,39.17 -2.92,39.05 -2.92,-6.29 -6.22,-9.6 178.69,-9.6 179.71,-8.58 179.71,77.27 175.9,81.08
GND on GND: 25.27,61.02 25.27,39.17 -0.51,39.17 -0.51,-1.21 -0.76,-1.47 152.91,-1.47 153.42,-0.96 153.42,60.76 153.16,61.02 25.27,61.02
VBAT on Top Layer: 105.16,14.15 112.14,14.15 112.14,3.23 105.16,3.23
VBAT on Top Layer: 54.99,11.99 57.91,11.99 57.91,8.31 54.99,8.31
VBAT on Bottom Layer: 54.99,11.99 57.15,11.99 57.15,8.31 54.99,8.31
VBAT on Bottom Layer: 108.71,11.1 112.14,11.1 112.14,3.23 108.71,3.23
VBAT_NEG on Top Layer: 20.45,16.31 22.86,16.31 22.86,14.41 20.45,14.41
VBAT_NEG on Bottom Layer: 20.45,16.31 22.86,16.31 22.86,14.41 20.45,14.41
VBAT_NEG on Bottom Layer: 17.14,12.12 18.16,12.12 18.16,9.58 17.14,9.58
AUX1 on Top Layer: 134.37,46.03 139.7,46.03 139.7,42.98 134.37,42.98
AUX2 on Top Layer: 131.83,56.44 134.37,56.44 134.37,52.63 131.83,52.63
BAT on Top Layer: 109.35,25.08 114.43,25.08 114.43,23.93 109.35,23.93
C7_1 on Top Layer: 52.45,50.6 55.5,50.6 55.5,47.68 52.45,47.68
C23_2 on Top Layer: 135.38,49.84 138.43,49.84 138.43,46.54 135.38,46.54
D1_1 on Top Layer: 59.31,14.79 61.34,14.79 61.34,9.33 59.31,9.33
D1_2 on Top Layer: 56.9,14.79 58.8,14.79 58.8,9.33 56.9,9.33
D5_1 on Top Layer: 27.18,2.72 30.23,2.72 30.23,0.94 27.18,0.94
MCP_CHRG on Top Layer: 4.19,13.14 5.33,13.14 5.33,10.09 4.19,10.09
PICO_ECG_AN on Top Layer: 54.48,48.7 58.29,48.7 58.29,46.16 54.48,46.16
Q1_1 on Top Layer: 85.34,44.89 88.26,44.89 88.26,42.6 85.34,42.6
Q6_2 on Top Layer: 18.42,20.88 21.72,20.88 21.72,19.87 18.42,19.87
R6_2 on Top Layer: 59.94,39.93 65.02,39.93 65.02,38.92 59.94,38.92
R36_2 on Top Layer: 2.29,15.42 5.33,15.42 5.33,14.15 2.29,14.15
SIG_CHARGE on Top Layer: 8.51,18.09 9.78,18.09 9.78,14.79 8.51,14.79
U3_8 on Top Layer: 58.42,52.51 59.44,52.51 59.44,47.68 58.42,47.68
U3_9 on Top Layer: 56.52,52.51 57.53,52.51 57.53,49.59 56.52,49.59
U3_18 on Top Layer: 57.78,41.84 59.31,41.84 59.31,37.14 57.78,37.14
U4_3 on Top Layer: 14.86,48.44 18.16,48.44 18.16,44.25 14.86,44.25
U6_5 on Top Layer: 101.47,12.88 106.68,12.88 106.68,3.23 101.47,3.23
USB_GND on Top Layer: 18.67,50.22 19.56,50.22 19.56,44.25 18.67,44.25
USB_GND on Top Layer: 22.99,63.05 22.99,43.11 22.22,42.35 -1.27,42.35 -1.27,63.17 -1.65,63.56
USB_GND on Bottom Layer: -1.52,42.35 22.22,42.35 22.99,43.11 22.99,62.29 -1.65,62.29 -2.03,62.67
USB_GND on GND: -0.64,42.35 22.22,42.35 22.99,43.11 22.99,60.89 -0.76,60.89 -0.89,60.76

## Text on the board
Bottom Silkscreen Layer: MASTER PROJECT V1 | REV01-FEB2024 | DESIGN BY: MILOS RASIC
Top Silkscreen Layer: SIG | VBAT | GND | SDA | SCL | 3V3 | B | A | L | R | CHARGING CIRCUIT | MAX 400mA | BAT CONN | BAT PROTECTION | BTN | 5V | 6V | POT1 | JUMPERS | POT2 | CONN | BPM PWR | CONN 6V | PWR BTN CONN | - | + | 5V PWR | ISOLATED | D+ | D- | CIRCUIT | 3V3 ENABLE | ECG | BUCK/BOOST 3V3 | B+ | B- | EXTERNAL | BUZZ CONN | POT1-AUX | POT2-GAIN | BOOST 6V | MULTIPLEXER | MPS20N | AUX IN CONN | P- | P+ | V- | AUX3 | AUX2 | AUX1 | V+ | INA826 | ENCODER | I2C1 PULL UP JMP | I2C0 PULL UP JMP | USB | BATTERY TP | BAT+ | BAT- | LA | RA | RL | LED NEO | BUZZER | SENSOR | BPM AIR | PRESSURE | BPM PUMP | BPM VALVE | BPM BUTTON | SEN MPS- | SEN MPS+ | I2C1 | I2C0 | *
